# Altium schematic sheet Current_Limit.SchDoc: Protection
size A3; Organization: ORGANIZATION; Address1: ADDRESS 1; Address2: ADDRESS 2; Address3: ADDRESS 3; Address4: ADDRESS 4; Revision: 0.0; SheetNumber: 17; SheetTotal: 19; ENG_APP_DATE: --/--/--; DSN_APP_DATE: --/--/--; CHK_APP_DATE: --/--/--
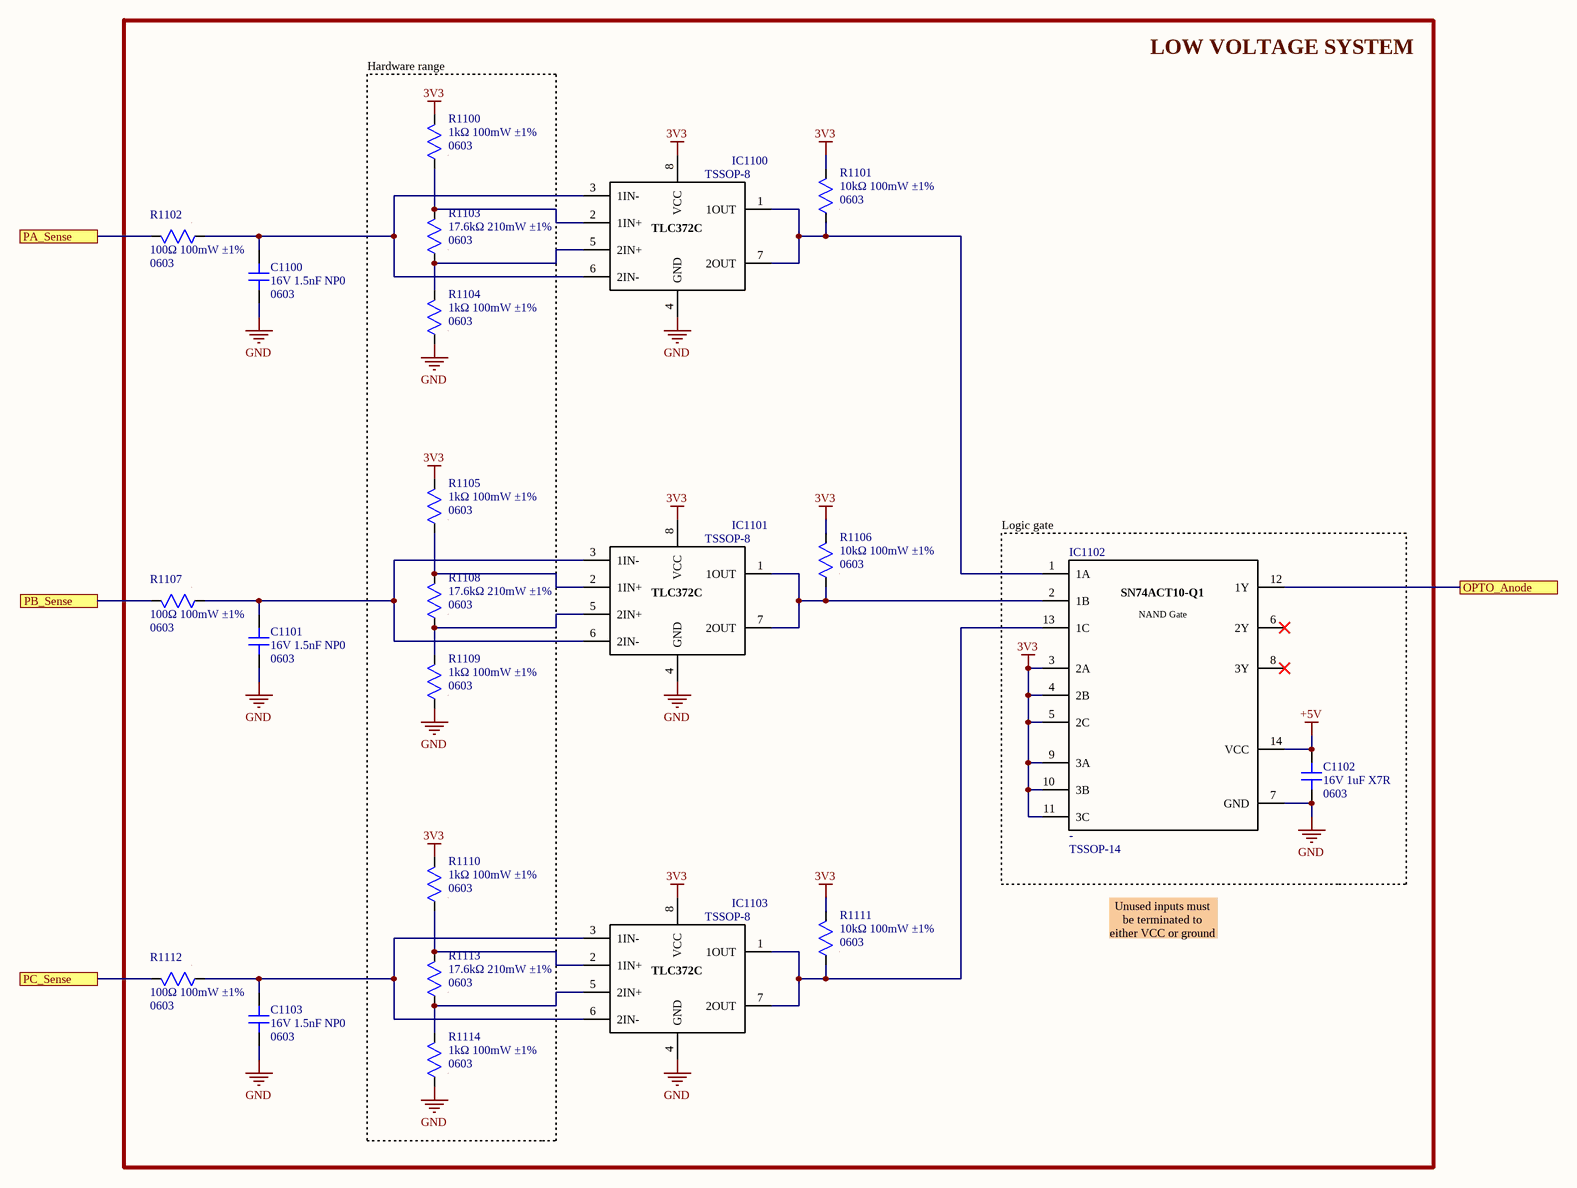
[diagram p0: Current_Limit.SchDoc]

## Parts
C1100  value 16V 1.5nF NP0  Package: 0603  [CAP SMD 0603]  (hidden comment: CAP non polarized)
C1101  value 16V 1.5nF NP0  Package: 0603  [CAP SMD 0603]  (hidden comment: CAP non polarized)
C1102  value 16V 1uF X7R  Package: 0603  [CAP SMD 0603]  (hidden comment: CAP non polarized)
C1103  value 16V 1.5nF NP0  Package: 0603  [CAP SMD 0603]  (hidden comment: CAP non polarized)
IC1100  TLC372C  [TSSOP-8]  (value not drawn)
IC1101  TLC372C  [TSSOP-8]  (value not drawn)
IC1102  SN74ACT10-Q1  [TSSOP-14]  (value not drawn)
IC1103  TLC372C  [TSSOP-8]  (value not drawn)
R1100  value 1kΩ 100mW ±1%  Package: 0603  [RES SMD 0603]  (hidden comment: RES)
R1101  value 10kΩ 100mW ±1%  Package: 0603  [RES SMD 0603]  (hidden comment: RES)
R1102  value 100Ω 100mW ±1%  Package: 0603  [RES SMD 0603]  (hidden comment: RES)
R1103  value 17.6kΩ 210mW ±1%  Package: 0603  [RES SMD 0603]  (hidden comment: RES)
R1104  value 1kΩ 100mW ±1%  Package: 0603  [RES SMD 0603]  (hidden comment: RES)
R1105  value 1kΩ 100mW ±1%  Package: 0603  [RES SMD 0603]  (hidden comment: RES)
R1106  value 10kΩ 100mW ±1%  Package: 0603  [RES SMD 0603]  (hidden comment: RES)
R1107  value 100Ω 100mW ±1%  Package: 0603  [RES SMD 0603]  (hidden comment: RES)
R1108  value 17.6kΩ 210mW ±1%  Package: 0603  [RES SMD 0603]  (hidden comment: RES)
R1109  value 1kΩ 100mW ±1%  Package: 0603  [RES SMD 0603]  (hidden comment: RES)
R1110  value 1kΩ 100mW ±1%  Package: 0603  [RES SMD 0603]  (hidden comment: RES)
R1111  value 10kΩ 100mW ±1%  Package: 0603  [RES SMD 0603]  (hidden comment: RES)
R1112  value 100Ω 100mW ±1%  Package: 0603  [RES SMD 0603]  (hidden comment: RES)
R1113  value 17.6kΩ 210mW ±1%  Package: 0603  [RES SMD 0603]  (hidden comment: RES)
R1114  value 1kΩ 100mW ±1%  Package: 0603  [RES SMD 0603]  (hidden comment: RES)

## Blocks framed on the sheet
LOW VOLTAGE SYSTEM: C1100 C1101 C1103 IC1100 IC1101 IC1103 R1101 R1102 R1106 R1107 R1111 R1112
Hardware range: R1100 R1103-R1105 R1108-R1110 R1113 R1114
Logic gate: C1102 IC1102

## Ports
OPTO_Anode, PA_Sense, PB_Sense, PC_Sense

## Nets
3V3: IC1100.8(VCC) IC1101.8(VCC) IC1102.3(2A) IC1102.4(2B) IC1102.5(2C) IC1102.9(3A) IC1102.10(3B) IC1102.11(3C) IC1103.8(VCC) R1100.2 R1101.2 R1105.2 R1106.2 R1110.2 R1111.2
+5V: C1102.2 IC1102.14(VCC)
GND: C1100.1 C1101.1 C1102.1 C1103.1 IC1100.4(GND) IC1101.4(GND) IC1102.7(GND) IC1103.4(GND) R1104.1 R1109.1 R1114.1
OPTO_Anode: IC1102.12(1Y) ; port OPTO_Anode
PA_Sense: R1102.2 ; port PA_Sense
PB_Sense: R1107.2 ; port PB_Sense
PC_Sense: R1112.2 ; port PC_Sense
NetC1100_2: C1100.2 IC1100.3(1IN-) IC1100.6(2IN-) R1102.1
NetC1101_2: C1101.2 IC1101.3(1IN-) IC1101.6(2IN-) R1107.1
NetC1103_2: C1103.2 IC1103.3(1IN-) IC1103.6(2IN-) R1112.1
NetIC1100_1: IC1100.1(1OUT) IC1100.7(2OUT) IC1102.1(1A) R1101.1
NetIC1100_2: IC1100.2(1IN+) R1100.1 R1103.2
NetIC1100_5: IC1100.5(2IN+) R1103.1 R1104.2
NetIC1101_1: IC1101.1(1OUT) IC1101.7(2OUT) IC1102.2(1B) R1106.1
NetIC1101_2: IC1101.2(1IN+) R1105.1 R1108.2
NetIC1101_5: IC1101.5(2IN+) R1108.1 R1109.2
NetIC1102_13: IC1102.13(1C) IC1103.1(1OUT) IC1103.7(2OUT) R1111.1
NetIC1103_2: IC1103.2(1IN+) R1110.1 R1113.2
NetIC1103_5: IC1103.5(2IN+) R1113.1 R1114.2

Not connected (* = marked no-connect by the designer): IC1102 6(2Y)* 8(3Y)*

## Notes on the sheet
- Unused inputs must be terminated to either VCC or ground
- Project:
- Subsystem:
- Company:
- Document:
- Author:
- Revision:
- Date:
- Sheet:
- /
- (in symbol 050-0006) NAND Gate

## Library data of the parts
C1100 C1101 C1103 = 001-0121: Condensadores de cerámica multicapa (MLCC- SMD/SMT) 25V 1500pF C0G 0603 1%; MPN: C0603C152F3GECTU; Manufacturer: KEMET; ComponentLink1Description: Datasheet; ComponentLink1URL: https://www.mouser.es/datasheet/3/508/1/KEM_C1091_C0G_ESD.pdf; ComponentLink2Description: Distributor Link; ComponentLink2URL: https://www.mouser.es/ProductDetail/KEMET/C0603C152F3GECTU?qs=Mv7BduZupUh%252Bk5D8ZWarTg%3D%3D; ID: 001-0121; Distributor PN: 80-C0603C152F3GEC; Distributor: Mouser
C1102 = 001-0110: Condensadores de cerámica multicapa (MLCC- SMD/SMT) WCAP-CSGP 1uF 0603 10% 16V MLCC; MPN: 885012206052; Manufacturer: Wurth Elektronik; ComponentLink1Description: Datasheet; ComponentLink1URL: https://www.we-online.com/components/products/datasheet/885012206052.pdf; ComponentLink2Description: Distributor Link; ComponentLink2URL: https://www.mouser.es/ProductDetail/Wurth-Elektronik/885012206052?qs=0KOYDY2FL2%2F2JKabApojcQ%3D%3D; ID: 001-0110; Distributor PN: 710-885012206052; Distributor: Mouser
IC1100 IC1101 IC1103 = 050-0005: Comparadores analógicos Dual Differential A 595-TLC372CPW A 595- A 595-TLC372CPW; MPN: TLC372CPWR; Manufacturer: Texas Instruments; ComponentLink1Description: Datasheet; ComponentLink1URL: https://www.ti.com/lit/ds/symlink/tlc372.pdf?ts=1782158413305&ref_url=https%253A%252F%252Fwww.mouser.es%252F; ComponentLink2Description: Distributor Link; ComponentLink2URL: https://www.mouser.es/ProductDetail/Texas-Instruments/TLC372CPWR?qs=Zu35EjizYSQJQcLjIiS2wQ%3D%3D; ID: 050-0005; Value: -; Package: TSSOP-8; Distributor PN: 595-TLC372CPWR; Distributor: Mouser
IC1102 = 050-0006: Puertas lógicas Automotive 3-ch 3- i nput 1.5V to 6V 24; MPN: SN74ACT10QPWRG4Q1; Manufacturer: Texas Instruments; ComponentLink1Description: Datasheet; ComponentLink1URL: https://www.ti.com/lit/ds/symlink/sn74act10-q1.pdf?ts=1755166715768&ref_url=https%253A%252F%252Fwww.ti.com%252Fsitesearch%252Fen-us%252Fdocs%252Funiversalsearch.tsp%253FlangPref%253Den-US%2526nr%253D2%2526searchTerm%253DSN74ACT10WBQARQ1; ComponentLink2Description: Distributor Link; ComponentLink2URL: https://www.mouser.es/ProductDetail/Texas-Instruments/SN74ACT10QPWRG4Q1?qs=sGAEpiMZZMutXGli8Ay4kFDTtzDUNYkmI6wEEhUY5cY%3D; ID: 050-0006; Value: -; Package: TSSOP-14; Distributor PN: 595-N74ACT10QPWRG4Q1; Distributor: Mouser
R1100 R1104 R1105 R1109 R1110 R1114 = 010-0170: Thick Film Resistors WRIS-RSKS 1 kOhms 1 % 0.1 W 0603 AEC-Q200; MPN: 560112116014; Manufacturer: Wurth Elektronik; ComponentLink1Description: Datasheet; ComponentLink1URL: https://www.we-online.com/components/products/datasheet/560112116014.pdf; ComponentLink2Description: Distributor Link; ComponentLink2URL: https://www.mouser.es/ProductDetail/Wurth-Elektronik/560112116014?qs=sGAEpiMZZMvdGkrng054txLI%2FDB4oIKD92viHLDiYpSVemZawWv4yQ%3D%3D; ID: 010-0170; Distributor PN: 710-560112116014; Distributor: Mouser
R1101 R1106 R1111 = 010-0145: Resistores de película gruesa - SMD WRIS-RSKS 10 kOhms 1 % 0.1 W 0603 AEC-Q200; MPN: 560112116005; Manufacturer: Wurth Elektronik; ComponentLink1Description: Datasheet; ComponentLink1URL: https://www.we-online.com/components/products/datasheet/560112116005.pdf; ComponentLink2Description: Distributor Link; ComponentLink2URL: https://www.mouser.es/ProductDetail/Wurth-Elektronik/560112116005?qs=mELouGlnn3dMVSPHwBGouA%3D%3D; ID: 010-0145; Distributor PN: 710-560112116005; Distributor: Mouser
R1102 R1107 R1112 = 010-0172: Thick Film Resistors WRIS-RSKS 100 Ohms 1 % 0.1 W 0603 AEC-Q200; MPN: 560112116009; Manufacturer: Wurth Elektronik; ComponentLink1Description: Datasheet; ComponentLink1URL: https://www.we-online.com/components/products/datasheet/560112116009.pdf; ComponentLink2Description: Distributor Link; ComponentLink2URL: https://www.mouser.es/ProductDetail/Wurth-Elektronik/560112116009?qs=sGAEpiMZZMvdGkrng054txLI%2FDB4oIKDTCqaE%2Fpesdwv2JWXHdCmlQ%3D%3D; ID: 010-0172; Distributor PN: 710-560112116009; Distributor: Mouser
R1103 R1108 R1113 = 010-0173: Thin Film Resistors 17.6Kohms .1% 25ppm; MPN: TNPW060317K6BEEA; Manufacturer: Vishay; ComponentLink1Description: Datasheet; ComponentLink1URL: https://www.vishay.com/docs/28758/tnpw_e3.pdf; ComponentLink2Description: Distributor Link; ComponentLink2URL: https://www.vishay.com/docs/28758/tnpw_e3.pdf; ID: 010-0173; Distributor PN: 71-TNPW060317K6BEEA; Distributor: Mouser